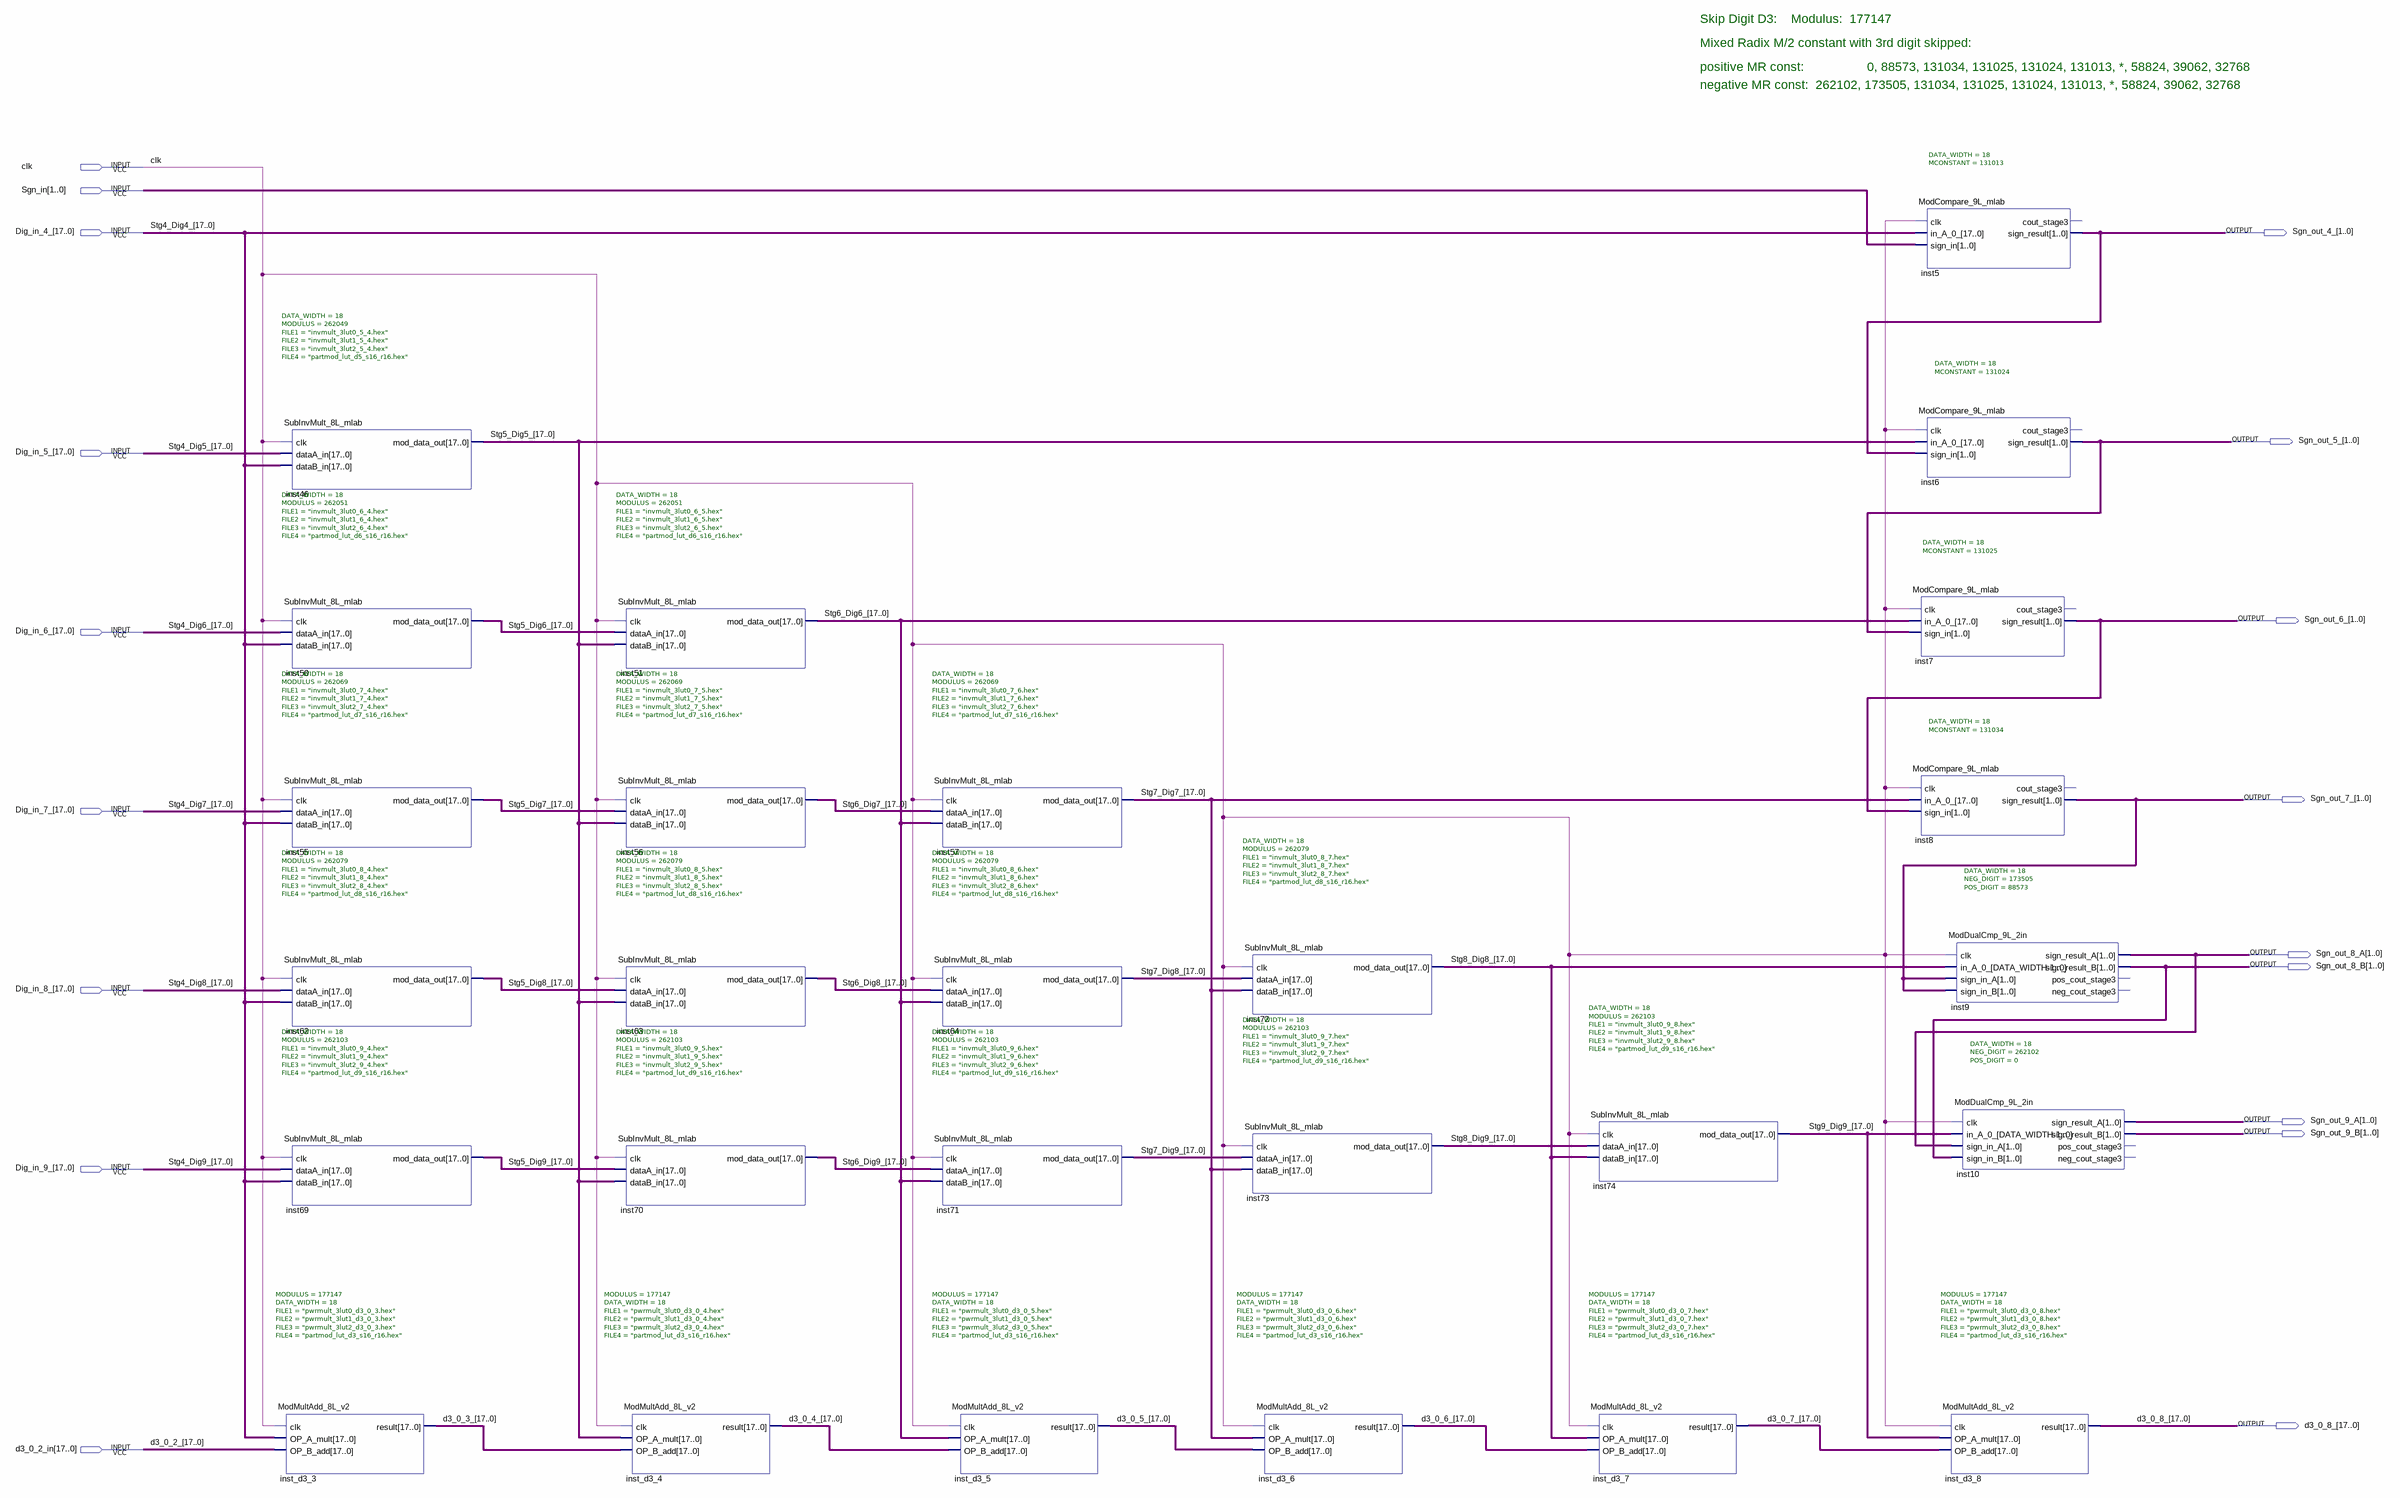
[diagram p0: schematic sheet]
// Quartus schematic MRC_pipe_mlab_ec_skp3.bdf as structural Verilog: 27 symbols, 18 pins
module MRC_pipe_mlab_ec_skp3 (
  input  clk,
  input  [1:0] Sgn_in,
  input  [17:0] Dig_in_4_,
  input  [17:0] Dig_in_5_,
  input  [17:0] Dig_in_6_,
  input  [17:0] Dig_in_7_,
  input  [17:0] Dig_in_8_,
  input  [17:0] Dig_in_9_,
  input  [17:0] d3_0_2_in,
  output [1:0] Sgn_out_4_,
  output [1:0] Sgn_out_5_,
  output [1:0] Sgn_out_6_,
  output [1:0] Sgn_out_7_,
  output [1:0] Sgn_out_8_A,
  output [1:0] Sgn_out_8_B,
  output [1:0] Sgn_out_9_A,
  output [1:0] Sgn_out_9_B,
  output [17:0] d3_0_8_
);

  wire [17:0] d3_0_3_, d3_0_4_, d3_0_5_, d3_0_6_, d3_0_7_, Stg5_Dig5_, Stg5_Dig6_, Stg5_Dig7_, Stg5_Dig8_,
       Stg5_Dig9_, Stg6_Dig6_, Stg6_Dig7_, Stg6_Dig8_, Stg6_Dig9_, Stg7_Dig7_, Stg7_Dig8_, Stg7_Dig9_,
       Stg8_Dig8_, Stg8_Dig9_, Stg9_Dig9_;

  ModMultAdd_8L_v2 #(.MODULUS(177147), .DATA_WIDTH(18), .FILE1("pwrmult_3lut0_d3_0_3.hex"), .FILE2("pwrmult_3lut1_d3_0_3.hex"), .FILE3("pwrmult_3lut2_d3_0_3.hex"), .FILE4("partmod_lut_d3_s16_r16.hex")) inst_d3_3 (
    .clk(clk), .OP_A_mult(Dig_in_4_), .OP_B_add(d3_0_2_in), .result(d3_0_3_));
  SubInvMult_8L_mlab #(.DATA_WIDTH(18), .MODULUS(262049), .FILE1("invmult_3lut0_5_4.hex"), .FILE2("invmult_3lut1_5_4.hex"), .FILE3("invmult_3lut2_5_4.hex"), .FILE4("partmod_lut_d5_s16_r16.hex")) inst46 (
    .clk(clk), .dataA_in(Dig_in_5_), .dataB_in(Dig_in_4_), .mod_data_out(Stg5_Dig5_));
  SubInvMult_8L_mlab #(.DATA_WIDTH(18), .MODULUS(262051), .FILE1("invmult_3lut0_6_4.hex"), .FILE2("invmult_3lut1_6_4.hex"), .FILE3("invmult_3lut2_6_4.hex"), .FILE4("partmod_lut_d6_s16_r16.hex")) inst50 (
    .clk(clk), .dataA_in(Dig_in_6_), .dataB_in(Dig_in_4_), .mod_data_out(Stg5_Dig6_));
  SubInvMult_8L_mlab #(.DATA_WIDTH(18), .MODULUS(262069), .FILE1("invmult_3lut0_7_4.hex"), .FILE2("invmult_3lut1_7_4.hex"), .FILE3("invmult_3lut2_7_4.hex"), .FILE4("partmod_lut_d7_s16_r16.hex")) inst55 (
    .clk(clk), .dataA_in(Dig_in_7_), .dataB_in(Dig_in_4_), .mod_data_out(Stg5_Dig7_));
  SubInvMult_8L_mlab #(.DATA_WIDTH(18), .MODULUS(262079), .FILE1("invmult_3lut0_8_4.hex"), .FILE2("invmult_3lut1_8_4.hex"), .FILE3("invmult_3lut2_8_4.hex"), .FILE4("partmod_lut_d8_s16_r16.hex")) inst62 (
    .clk(clk), .dataA_in(Dig_in_8_), .dataB_in(Dig_in_4_), .mod_data_out(Stg5_Dig8_));
  SubInvMult_8L_mlab #(.DATA_WIDTH(18), .MODULUS(262103), .FILE1("invmult_3lut0_9_4.hex"), .FILE2("invmult_3lut1_9_4.hex"), .FILE3("invmult_3lut2_9_4.hex"), .FILE4("partmod_lut_d9_s16_r16.hex")) inst69 (
    .clk(clk), .dataA_in(Dig_in_9_), .dataB_in(Dig_in_4_), .mod_data_out(Stg5_Dig9_));
  SubInvMult_8L_mlab #(.DATA_WIDTH(18), .MODULUS(262051), .FILE1("invmult_3lut0_6_5.hex"), .FILE2("invmult_3lut1_6_5.hex"), .FILE3("invmult_3lut2_6_5.hex"), .FILE4("partmod_lut_d6_s16_r16.hex")) inst51 (
    .clk(clk), .dataA_in(Stg5_Dig6_), .dataB_in(Stg5_Dig5_), .mod_data_out(Stg6_Dig6_));
  SubInvMult_8L_mlab #(.DATA_WIDTH(18), .MODULUS(262069), .FILE1("invmult_3lut0_7_5.hex"), .FILE2("invmult_3lut1_7_5.hex"), .FILE3("invmult_3lut2_7_5.hex"), .FILE4("partmod_lut_d7_s16_r16.hex")) inst56 (
    .clk(clk), .dataA_in(Stg5_Dig7_), .dataB_in(Stg5_Dig5_), .mod_data_out(Stg6_Dig7_));
  SubInvMult_8L_mlab #(.DATA_WIDTH(18), .MODULUS(262079), .FILE1("invmult_3lut0_8_5.hex"), .FILE2("invmult_3lut1_8_5.hex"), .FILE3("invmult_3lut2_8_5.hex"), .FILE4("partmod_lut_d8_s16_r16.hex")) inst63 (
    .clk(clk), .dataA_in(Stg5_Dig8_), .dataB_in(Stg5_Dig5_), .mod_data_out(Stg6_Dig8_));
  SubInvMult_8L_mlab #(.DATA_WIDTH(18), .MODULUS(262103), .FILE1("invmult_3lut0_9_5.hex"), .FILE2("invmult_3lut1_9_5.hex"), .FILE3("invmult_3lut2_9_5.hex"), .FILE4("partmod_lut_d9_s16_r16.hex")) inst70 (
    .clk(clk), .dataA_in(Stg5_Dig9_), .dataB_in(Stg5_Dig5_), .mod_data_out(Stg6_Dig9_));
  ModMultAdd_8L_v2 #(.MODULUS(177147), .DATA_WIDTH(18), .FILE1("pwrmult_3lut0_d3_0_4.hex"), .FILE2("pwrmult_3lut1_d3_0_4.hex"), .FILE3("pwrmult_3lut2_d3_0_4.hex"), .FILE4("partmod_lut_d3_s16_r16.hex")) inst_d3_4 (
    .clk(clk), .OP_A_mult(Stg5_Dig5_), .OP_B_add(d3_0_3_), .result(d3_0_4_));
  SubInvMult_8L_mlab #(.DATA_WIDTH(18), .MODULUS(262069), .FILE1("invmult_3lut0_7_6.hex"), .FILE2("invmult_3lut1_7_6.hex"), .FILE3("invmult_3lut2_7_6.hex"), .FILE4("partmod_lut_d7_s16_r16.hex")) inst57 (
    .clk(clk), .dataA_in(Stg6_Dig7_), .dataB_in(Stg6_Dig6_), .mod_data_out(Stg7_Dig7_));
  SubInvMult_8L_mlab #(.DATA_WIDTH(18), .MODULUS(262079), .FILE1("invmult_3lut0_8_6.hex"), .FILE2("invmult_3lut1_8_6.hex"), .FILE3("invmult_3lut2_8_6.hex"), .FILE4("partmod_lut_d8_s16_r16.hex")) inst64 (
    .clk(clk), .dataA_in(Stg6_Dig8_), .dataB_in(Stg6_Dig6_), .mod_data_out(Stg7_Dig8_));
  SubInvMult_8L_mlab #(.DATA_WIDTH(18), .MODULUS(262103), .FILE1("invmult_3lut0_9_6.hex"), .FILE2("invmult_3lut1_9_6.hex"), .FILE3("invmult_3lut2_9_6.hex"), .FILE4("partmod_lut_d9_s16_r16.hex")) inst71 (
    .clk(clk), .dataA_in(Stg6_Dig9_), .dataB_in(Stg6_Dig6_), .mod_data_out(Stg7_Dig9_));
  ModMultAdd_8L_v2 #(.MODULUS(177147), .DATA_WIDTH(18), .FILE1("pwrmult_3lut0_d3_0_5.hex"), .FILE2("pwrmult_3lut1_d3_0_5.hex"), .FILE3("pwrmult_3lut2_d3_0_5.hex"), .FILE4("partmod_lut_d3_s16_r16.hex")) inst_d3_5 (
    .clk(clk), .OP_A_mult(Stg6_Dig6_), .OP_B_add(d3_0_4_), .result(d3_0_5_));
  SubInvMult_8L_mlab #(.DATA_WIDTH(18), .MODULUS(262079), .FILE1("invmult_3lut0_8_7.hex"), .FILE2("invmult_3lut1_8_7.hex"), .FILE3("invmult_3lut2_8_7.hex"), .FILE4("partmod_lut_d8_s16_r16.hex")) inst72 (
    .clk(clk), .dataA_in(Stg7_Dig8_), .dataB_in(Stg7_Dig7_), .mod_data_out(Stg8_Dig8_));
  SubInvMult_8L_mlab #(.DATA_WIDTH(18), .MODULUS(262103), .FILE1("invmult_3lut0_9_7.hex"), .FILE2("invmult_3lut1_9_7.hex"), .FILE3("invmult_3lut2_9_7.hex"), .FILE4("partmod_lut_d9_s16_r16.hex")) inst73 (
    .clk(clk), .dataA_in(Stg7_Dig9_), .dataB_in(Stg7_Dig7_), .mod_data_out(Stg8_Dig9_));
  ModMultAdd_8L_v2 #(.MODULUS(177147), .DATA_WIDTH(18), .FILE1("pwrmult_3lut0_d3_0_6.hex"), .FILE2("pwrmult_3lut1_d3_0_6.hex"), .FILE3("pwrmult_3lut2_d3_0_6.hex"), .FILE4("partmod_lut_d3_s16_r16.hex")) inst_d3_6 (
    .clk(clk), .OP_A_mult(Stg7_Dig7_), .OP_B_add(d3_0_5_), .result(d3_0_6_));
  SubInvMult_8L_mlab #(.DATA_WIDTH(18), .MODULUS(262103), .FILE1("invmult_3lut0_9_8.hex"), .FILE2("invmult_3lut1_9_8.hex"), .FILE3("invmult_3lut2_9_8.hex"), .FILE4("partmod_lut_d9_s16_r16.hex")) inst74 (
    .clk(clk), .dataA_in(Stg8_Dig9_), .dataB_in(Stg8_Dig8_), .mod_data_out(Stg9_Dig9_));
  ModMultAdd_8L_v2 #(.MODULUS(177147), .DATA_WIDTH(18), .FILE1("pwrmult_3lut0_d3_0_7.hex"), .FILE2("pwrmult_3lut1_d3_0_7.hex"), .FILE3("pwrmult_3lut2_d3_0_7.hex"), .FILE4("partmod_lut_d3_s16_r16.hex")) inst_d3_7 (
    .clk(clk), .OP_A_mult(Stg8_Dig8_), .OP_B_add(d3_0_6_), .result(d3_0_7_));
  ModCompare_9L_mlab #(.DATA_WIDTH(18), .MCONSTANT(131013)) inst5 (
    .clk(clk), .in_A_0_(Dig_in_4_), .sign_in(Sgn_in), .sign_result(Sgn_out_4_));  // open: cout_stage3
  ModCompare_9L_mlab #(.DATA_WIDTH(18), .MCONSTANT(131024)) inst6 (
    .clk(clk), .in_A_0_(Stg5_Dig5_), .sign_in(Sgn_out_4_), .sign_result(Sgn_out_5_));  // open: cout_stage3
  ModCompare_9L_mlab #(.DATA_WIDTH(18), .MCONSTANT(131025)) inst7 (
    .clk(clk), .in_A_0_(Stg6_Dig6_), .sign_in(Sgn_out_5_), .sign_result(Sgn_out_6_));  // open: cout_stage3
  ModCompare_9L_mlab #(.DATA_WIDTH(18), .MCONSTANT(131034)) inst8 (
    .clk(clk), .in_A_0_(Stg7_Dig7_), .sign_in(Sgn_out_6_), .sign_result(Sgn_out_7_));  // open: cout_stage3
  ModDualCmp_9L_2in #(.DATA_WIDTH(18), .NEG_DIGIT(173505), .POS_DIGIT(88573)) inst9 (
    .clk(clk), .in_A_0_(Stg8_Dig8_), .sign_in_A(Sgn_out_7_), .sign_in_B(Sgn_out_7_),
    .sign_result_A(Sgn_out_8_A), .sign_result_B(Sgn_out_8_B));  // open: pos_cout_stage3, neg_cout_stage3
  ModMultAdd_8L_v2 #(.MODULUS(177147), .DATA_WIDTH(18), .FILE1("pwrmult_3lut0_d3_0_8.hex"), .FILE2("pwrmult_3lut1_d3_0_8.hex"), .FILE3("pwrmult_3lut2_d3_0_8.hex"), .FILE4("partmod_lut_d3_s16_r16.hex")) inst_d3_8 (
    .clk(clk), .OP_A_mult(Stg9_Dig9_), .OP_B_add(d3_0_7_), .result(d3_0_8_));
  ModDualCmp_9L_2in #(.DATA_WIDTH(18), .NEG_DIGIT(262102), .POS_DIGIT(0)) inst10 (
    .clk(clk), .in_A_0_(Stg9_Dig9_), .sign_in_A(Sgn_out_8_A), .sign_in_B(Sgn_out_8_B),
    .sign_result_A(Sgn_out_9_A), .sign_result_B(Sgn_out_9_B));  // open: pos_cout_stage3, neg_cout_stage3

  // Other names for the same wires on the sheet: d3_0_2_[17:0] = d3_0_2_in; Stg4_Dig4_[17:0] = Dig_in_4_;
  //   Stg4_Dig5_[17:0] = Dig_in_5_; Stg4_Dig6_[17:0] = Dig_in_6_; Stg4_Dig7_[17:0] = Dig_in_7_;
  //   Stg4_Dig8_[17:0] = Dig_in_8_; Stg4_Dig9_[17:0] = Dig_in_9_

  // Notes on the sheet:
  //   Skip Digit D3:    Modulus:  177147  
  //   Mixed Radix M/2 constant with 3rd digit skipped:
  //   positive MR const:                  0, 88573, 131034, 131025, 131024, 131013, *, 58824, 39062, 32768
  //   negative MR const:  262102, 173505, 131034, 131025, 131024, 131013, *, 58824, 39062, 32768
endmodule
